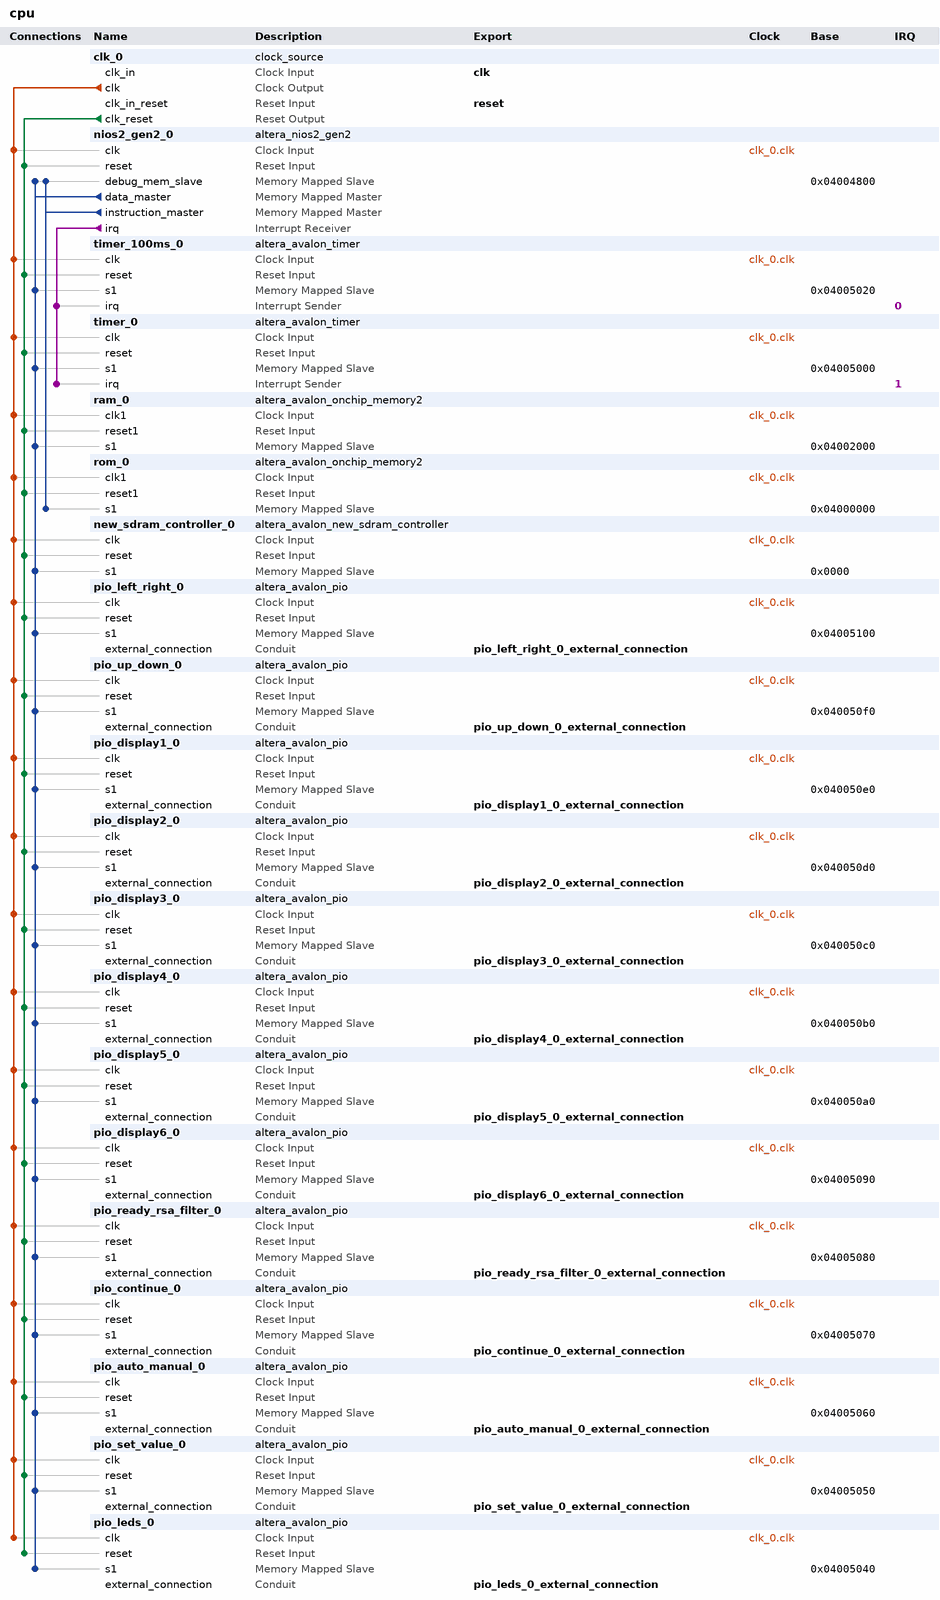
[diagram p0: system contents]
# Platform Designer (Qsys) system cpu, Cyclone V 5CSEMA5F31C6
# Parameters at their usual value, and those the tool derives, are not listed.
package require -exact qsys 20.1
create_system cpu
set_project_property DEVICE_FAMILY {Cyclone V}
set_project_property DEVICE 5CSEMA5F31C6

add_instance clk_0 clock_source 20.1
set_instance_parameter_value clk_0 clockFrequency 50000000

add_instance nios2_gen2_0 altera_nios2_gen2 20.1
set_instance_parameter_value nios2_gen2_0 dcache_size 2048
set_instance_parameter_value nios2_gen2_0 exceptionSlave rom_0.s1
set_instance_parameter_value nios2_gen2_0 icache_size 4096
set_instance_parameter_value nios2_gen2_0 impl Tiny
set_instance_parameter_value nios2_gen2_0 resetSlave rom_0.s1

add_instance timer_100ms_0 altera_avalon_timer 20.1
set_instance_parameter_value timer_100ms_0 alwaysRun true
set_instance_parameter_value timer_100ms_0 fixedPeriod true
set_instance_parameter_value timer_100ms_0 period 100
set_instance_parameter_value timer_100ms_0 periodUnits MSEC
set_instance_parameter_value timer_100ms_0 snapshot false

add_instance timer_0 altera_avalon_timer 20.1
set_instance_parameter_value timer_0 alwaysRun true
set_instance_parameter_value timer_0 fixedPeriod true
set_instance_parameter_value timer_0 period 1
set_instance_parameter_value timer_0 periodUnits SEC
set_instance_parameter_value timer_0 snapshot false

add_instance ram_0 altera_avalon_onchip_memory2 20.1
set_instance_parameter_value ram_0 dataWidth 32
set_instance_parameter_value ram_0 dualPort false
set_instance_parameter_value ram_0 initMemContent true
set_instance_parameter_value ram_0 initializationFileName onchip_mem.hex
set_instance_parameter_value ram_0 memorySize 8192

add_instance rom_0 altera_avalon_onchip_memory2 20.1
set_instance_parameter_value rom_0 dataWidth 32
set_instance_parameter_value rom_0 dualPort false
set_instance_parameter_value rom_0 initMemContent true
set_instance_parameter_value rom_0 initializationFileName onchip_mem.hex
set_instance_parameter_value rom_0 memorySize 8192
set_instance_parameter_value rom_0 writable false

add_instance new_sdram_controller_0 altera_avalon_new_sdram_controller 20.1
set_instance_parameter_value new_sdram_controller_0 TAC 5.4
set_instance_parameter_value new_sdram_controller_0 TRCD 20.0
set_instance_parameter_value new_sdram_controller_0 TRP 20.0
set_instance_parameter_value new_sdram_controller_0 casLatency 2
set_instance_parameter_value new_sdram_controller_0 columnWidth 8
set_instance_parameter_value new_sdram_controller_0 dataWidth 32
set_instance_parameter_value new_sdram_controller_0 generateSimulationModel false
set_instance_parameter_value new_sdram_controller_0 model single_Micron_MT48LC4M32B2_7_chip
set_instance_parameter_value new_sdram_controller_0 numberOfBanks 4
set_instance_parameter_value new_sdram_controller_0 numberOfChipSelects 1
set_instance_parameter_value new_sdram_controller_0 powerUpDelay 100.0
set_instance_parameter_value new_sdram_controller_0 refreshPeriod 15.625
set_instance_parameter_value new_sdram_controller_0 rowWidth 14

add_instance pio_left_right_0 altera_avalon_pio 20.1
set_instance_parameter_value pio_left_right_0 direction Input
set_instance_parameter_value pio_left_right_0 width 2

add_instance pio_up_down_0 altera_avalon_pio 20.1
set_instance_parameter_value pio_up_down_0 direction Input
set_instance_parameter_value pio_up_down_0 width 2

add_instance pio_display1_0 altera_avalon_pio 20.1
set_instance_parameter_value pio_display1_0 direction Output
set_instance_parameter_value pio_display1_0 width 7

add_instance pio_display2_0 altera_avalon_pio 20.1
set_instance_parameter_value pio_display2_0 direction Output
set_instance_parameter_value pio_display2_0 width 7

add_instance pio_display3_0 altera_avalon_pio 20.1
set_instance_parameter_value pio_display3_0 direction Output
set_instance_parameter_value pio_display3_0 width 7

add_instance pio_display4_0 altera_avalon_pio 20.1
set_instance_parameter_value pio_display4_0 direction Output
set_instance_parameter_value pio_display4_0 width 7

add_instance pio_display5_0 altera_avalon_pio 20.1
set_instance_parameter_value pio_display5_0 direction Output
set_instance_parameter_value pio_display5_0 width 7

add_instance pio_display6_0 altera_avalon_pio 20.1
set_instance_parameter_value pio_display6_0 direction Output
set_instance_parameter_value pio_display6_0 width 7

add_instance pio_ready_rsa_filter_0 altera_avalon_pio 20.1
set_instance_parameter_value pio_ready_rsa_filter_0 direction Output
set_instance_parameter_value pio_ready_rsa_filter_0 width 2

add_instance pio_continue_0 altera_avalon_pio 20.1
set_instance_parameter_value pio_continue_0 direction Input
set_instance_parameter_value pio_continue_0 width 1

add_instance pio_auto_manual_0 altera_avalon_pio 20.1
set_instance_parameter_value pio_auto_manual_0 direction Input
set_instance_parameter_value pio_auto_manual_0 width 1

add_instance pio_set_value_0 altera_avalon_pio 20.1
set_instance_parameter_value pio_set_value_0 direction Input
set_instance_parameter_value pio_set_value_0 width 1

add_instance pio_leds_0 altera_avalon_pio 20.1
set_instance_parameter_value pio_leds_0 direction Output
set_instance_parameter_value pio_leds_0 width 8

# connections
add_connection clk_0.clk new_sdram_controller_0.clk clock
add_connection clk_0.clk nios2_gen2_0.clk clock
add_connection clk_0.clk pio_auto_manual_0.clk clock
add_connection clk_0.clk pio_continue_0.clk clock
add_connection clk_0.clk pio_display1_0.clk clock
add_connection clk_0.clk pio_display2_0.clk clock
add_connection clk_0.clk pio_display3_0.clk clock
add_connection clk_0.clk pio_display4_0.clk clock
add_connection clk_0.clk pio_display5_0.clk clock
add_connection clk_0.clk pio_display6_0.clk clock
add_connection clk_0.clk pio_leds_0.clk clock
add_connection clk_0.clk pio_left_right_0.clk clock
add_connection clk_0.clk pio_ready_rsa_filter_0.clk clock
add_connection clk_0.clk pio_set_value_0.clk clock
add_connection clk_0.clk pio_up_down_0.clk clock
add_connection clk_0.clk ram_0.clk1 clock
add_connection clk_0.clk rom_0.clk1 clock
add_connection clk_0.clk timer_0.clk clock
add_connection clk_0.clk timer_100ms_0.clk clock
add_connection clk_0.clk_reset new_sdram_controller_0.reset reset
add_connection clk_0.clk_reset nios2_gen2_0.reset reset
add_connection clk_0.clk_reset pio_auto_manual_0.reset reset
add_connection clk_0.clk_reset pio_continue_0.reset reset
add_connection clk_0.clk_reset pio_display1_0.reset reset
add_connection clk_0.clk_reset pio_display2_0.reset reset
add_connection clk_0.clk_reset pio_display3_0.reset reset
add_connection clk_0.clk_reset pio_display4_0.reset reset
add_connection clk_0.clk_reset pio_display5_0.reset reset
add_connection clk_0.clk_reset pio_display6_0.reset reset
add_connection clk_0.clk_reset pio_leds_0.reset reset
add_connection clk_0.clk_reset pio_left_right_0.reset reset
add_connection clk_0.clk_reset pio_ready_rsa_filter_0.reset reset
add_connection clk_0.clk_reset pio_set_value_0.reset reset
add_connection clk_0.clk_reset pio_up_down_0.reset reset
add_connection clk_0.clk_reset ram_0.reset1 reset
add_connection clk_0.clk_reset rom_0.reset1 reset
add_connection clk_0.clk_reset timer_0.reset reset
add_connection clk_0.clk_reset timer_100ms_0.reset reset
add_connection nios2_gen2_0.data_master new_sdram_controller_0.s1 avalon
set_connection_parameter_value nios2_gen2_0.data_master/new_sdram_controller_0.s1 baseAddress 0x0000
add_connection nios2_gen2_0.data_master nios2_gen2_0.debug_mem_slave avalon
set_connection_parameter_value nios2_gen2_0.data_master/nios2_gen2_0.debug_mem_slave baseAddress 0x04004800
add_connection nios2_gen2_0.data_master pio_auto_manual_0.s1 avalon
set_connection_parameter_value nios2_gen2_0.data_master/pio_auto_manual_0.s1 baseAddress 0x04005060
add_connection nios2_gen2_0.data_master pio_continue_0.s1 avalon
set_connection_parameter_value nios2_gen2_0.data_master/pio_continue_0.s1 baseAddress 0x04005070
add_connection nios2_gen2_0.data_master pio_display1_0.s1 avalon
set_connection_parameter_value nios2_gen2_0.data_master/pio_display1_0.s1 baseAddress 0x040050e0
add_connection nios2_gen2_0.data_master pio_display2_0.s1 avalon
set_connection_parameter_value nios2_gen2_0.data_master/pio_display2_0.s1 baseAddress 0x040050d0
add_connection nios2_gen2_0.data_master pio_display3_0.s1 avalon
set_connection_parameter_value nios2_gen2_0.data_master/pio_display3_0.s1 baseAddress 0x040050c0
add_connection nios2_gen2_0.data_master pio_display4_0.s1 avalon
set_connection_parameter_value nios2_gen2_0.data_master/pio_display4_0.s1 baseAddress 0x040050b0
add_connection nios2_gen2_0.data_master pio_display5_0.s1 avalon
set_connection_parameter_value nios2_gen2_0.data_master/pio_display5_0.s1 baseAddress 0x040050a0
add_connection nios2_gen2_0.data_master pio_display6_0.s1 avalon
set_connection_parameter_value nios2_gen2_0.data_master/pio_display6_0.s1 baseAddress 0x04005090
add_connection nios2_gen2_0.data_master pio_leds_0.s1 avalon
set_connection_parameter_value nios2_gen2_0.data_master/pio_leds_0.s1 baseAddress 0x04005040
add_connection nios2_gen2_0.data_master pio_left_right_0.s1 avalon
set_connection_parameter_value nios2_gen2_0.data_master/pio_left_right_0.s1 baseAddress 0x04005100
add_connection nios2_gen2_0.data_master pio_ready_rsa_filter_0.s1 avalon
set_connection_parameter_value nios2_gen2_0.data_master/pio_ready_rsa_filter_0.s1 baseAddress 0x04005080
add_connection nios2_gen2_0.data_master pio_set_value_0.s1 avalon
set_connection_parameter_value nios2_gen2_0.data_master/pio_set_value_0.s1 baseAddress 0x04005050
add_connection nios2_gen2_0.data_master pio_up_down_0.s1 avalon
set_connection_parameter_value nios2_gen2_0.data_master/pio_up_down_0.s1 baseAddress 0x040050f0
add_connection nios2_gen2_0.data_master ram_0.s1 avalon
set_connection_parameter_value nios2_gen2_0.data_master/ram_0.s1 baseAddress 0x04002000
add_connection nios2_gen2_0.data_master timer_0.s1 avalon
set_connection_parameter_value nios2_gen2_0.data_master/timer_0.s1 baseAddress 0x04005000
add_connection nios2_gen2_0.data_master timer_100ms_0.s1 avalon
set_connection_parameter_value nios2_gen2_0.data_master/timer_100ms_0.s1 baseAddress 0x04005020
add_connection nios2_gen2_0.instruction_master nios2_gen2_0.debug_mem_slave avalon
set_connection_parameter_value nios2_gen2_0.instruction_master/nios2_gen2_0.debug_mem_slave baseAddress 0x04004800
add_connection nios2_gen2_0.instruction_master rom_0.s1 avalon
set_connection_parameter_value nios2_gen2_0.instruction_master/rom_0.s1 baseAddress 0x04000000
add_connection nios2_gen2_0.irq timer_0.irq interrupt
set_connection_parameter_value nios2_gen2_0.irq/timer_0.irq irqNumber 1
add_connection nios2_gen2_0.irq timer_100ms_0.irq interrupt
set_connection_parameter_value nios2_gen2_0.irq/timer_100ms_0.irq irqNumber 0

# exported interfaces
add_interface clk clock sink
set_interface_property clk EXPORT_OF clk_0.clk_in
add_interface pio_auto_manual_0_external_connection conduit end
set_interface_property pio_auto_manual_0_external_connection EXPORT_OF pio_auto_manual_0.external_connection
add_interface pio_continue_0_external_connection conduit end
set_interface_property pio_continue_0_external_connection EXPORT_OF pio_continue_0.external_connection
add_interface pio_display1_0_external_connection conduit end
set_interface_property pio_display1_0_external_connection EXPORT_OF pio_display1_0.external_connection
add_interface pio_display2_0_external_connection conduit end
set_interface_property pio_display2_0_external_connection EXPORT_OF pio_display2_0.external_connection
add_interface pio_display3_0_external_connection conduit end
set_interface_property pio_display3_0_external_connection EXPORT_OF pio_display3_0.external_connection
add_interface pio_display4_0_external_connection conduit end
set_interface_property pio_display4_0_external_connection EXPORT_OF pio_display4_0.external_connection
add_interface pio_display5_0_external_connection conduit end
set_interface_property pio_display5_0_external_connection EXPORT_OF pio_display5_0.external_connection
add_interface pio_display6_0_external_connection conduit end
set_interface_property pio_display6_0_external_connection EXPORT_OF pio_display6_0.external_connection
add_interface pio_leds_0_external_connection conduit end
set_interface_property pio_leds_0_external_connection EXPORT_OF pio_leds_0.external_connection
add_interface pio_left_right_0_external_connection conduit end
set_interface_property pio_left_right_0_external_connection EXPORT_OF pio_left_right_0.external_connection
add_interface pio_ready_rsa_filter_0_external_connection conduit end
set_interface_property pio_ready_rsa_filter_0_external_connection EXPORT_OF pio_ready_rsa_filter_0.external_connection
add_interface pio_set_value_0_external_connection conduit end
set_interface_property pio_set_value_0_external_connection EXPORT_OF pio_set_value_0.external_connection
add_interface pio_up_down_0_external_connection conduit end
set_interface_property pio_up_down_0_external_connection EXPORT_OF pio_up_down_0.external_connection
add_interface reset reset sink
set_interface_property reset EXPORT_OF clk_0.clk_in_reset

set_interconnect_requirement {$system} qsys_mm.clockCrossingAdapter HANDSHAKE
set_interconnect_requirement {$system} qsys_mm.enableEccProtection FALSE
set_interconnect_requirement {$system} qsys_mm.insertDefaultSlave FALSE
set_interconnect_requirement {$system} qsys_mm.maxAdditionalLatency 1

save_system cpu.qsys
